# Altium schematic sheet 行天宮-流亡暗道.SchDoc
size A3
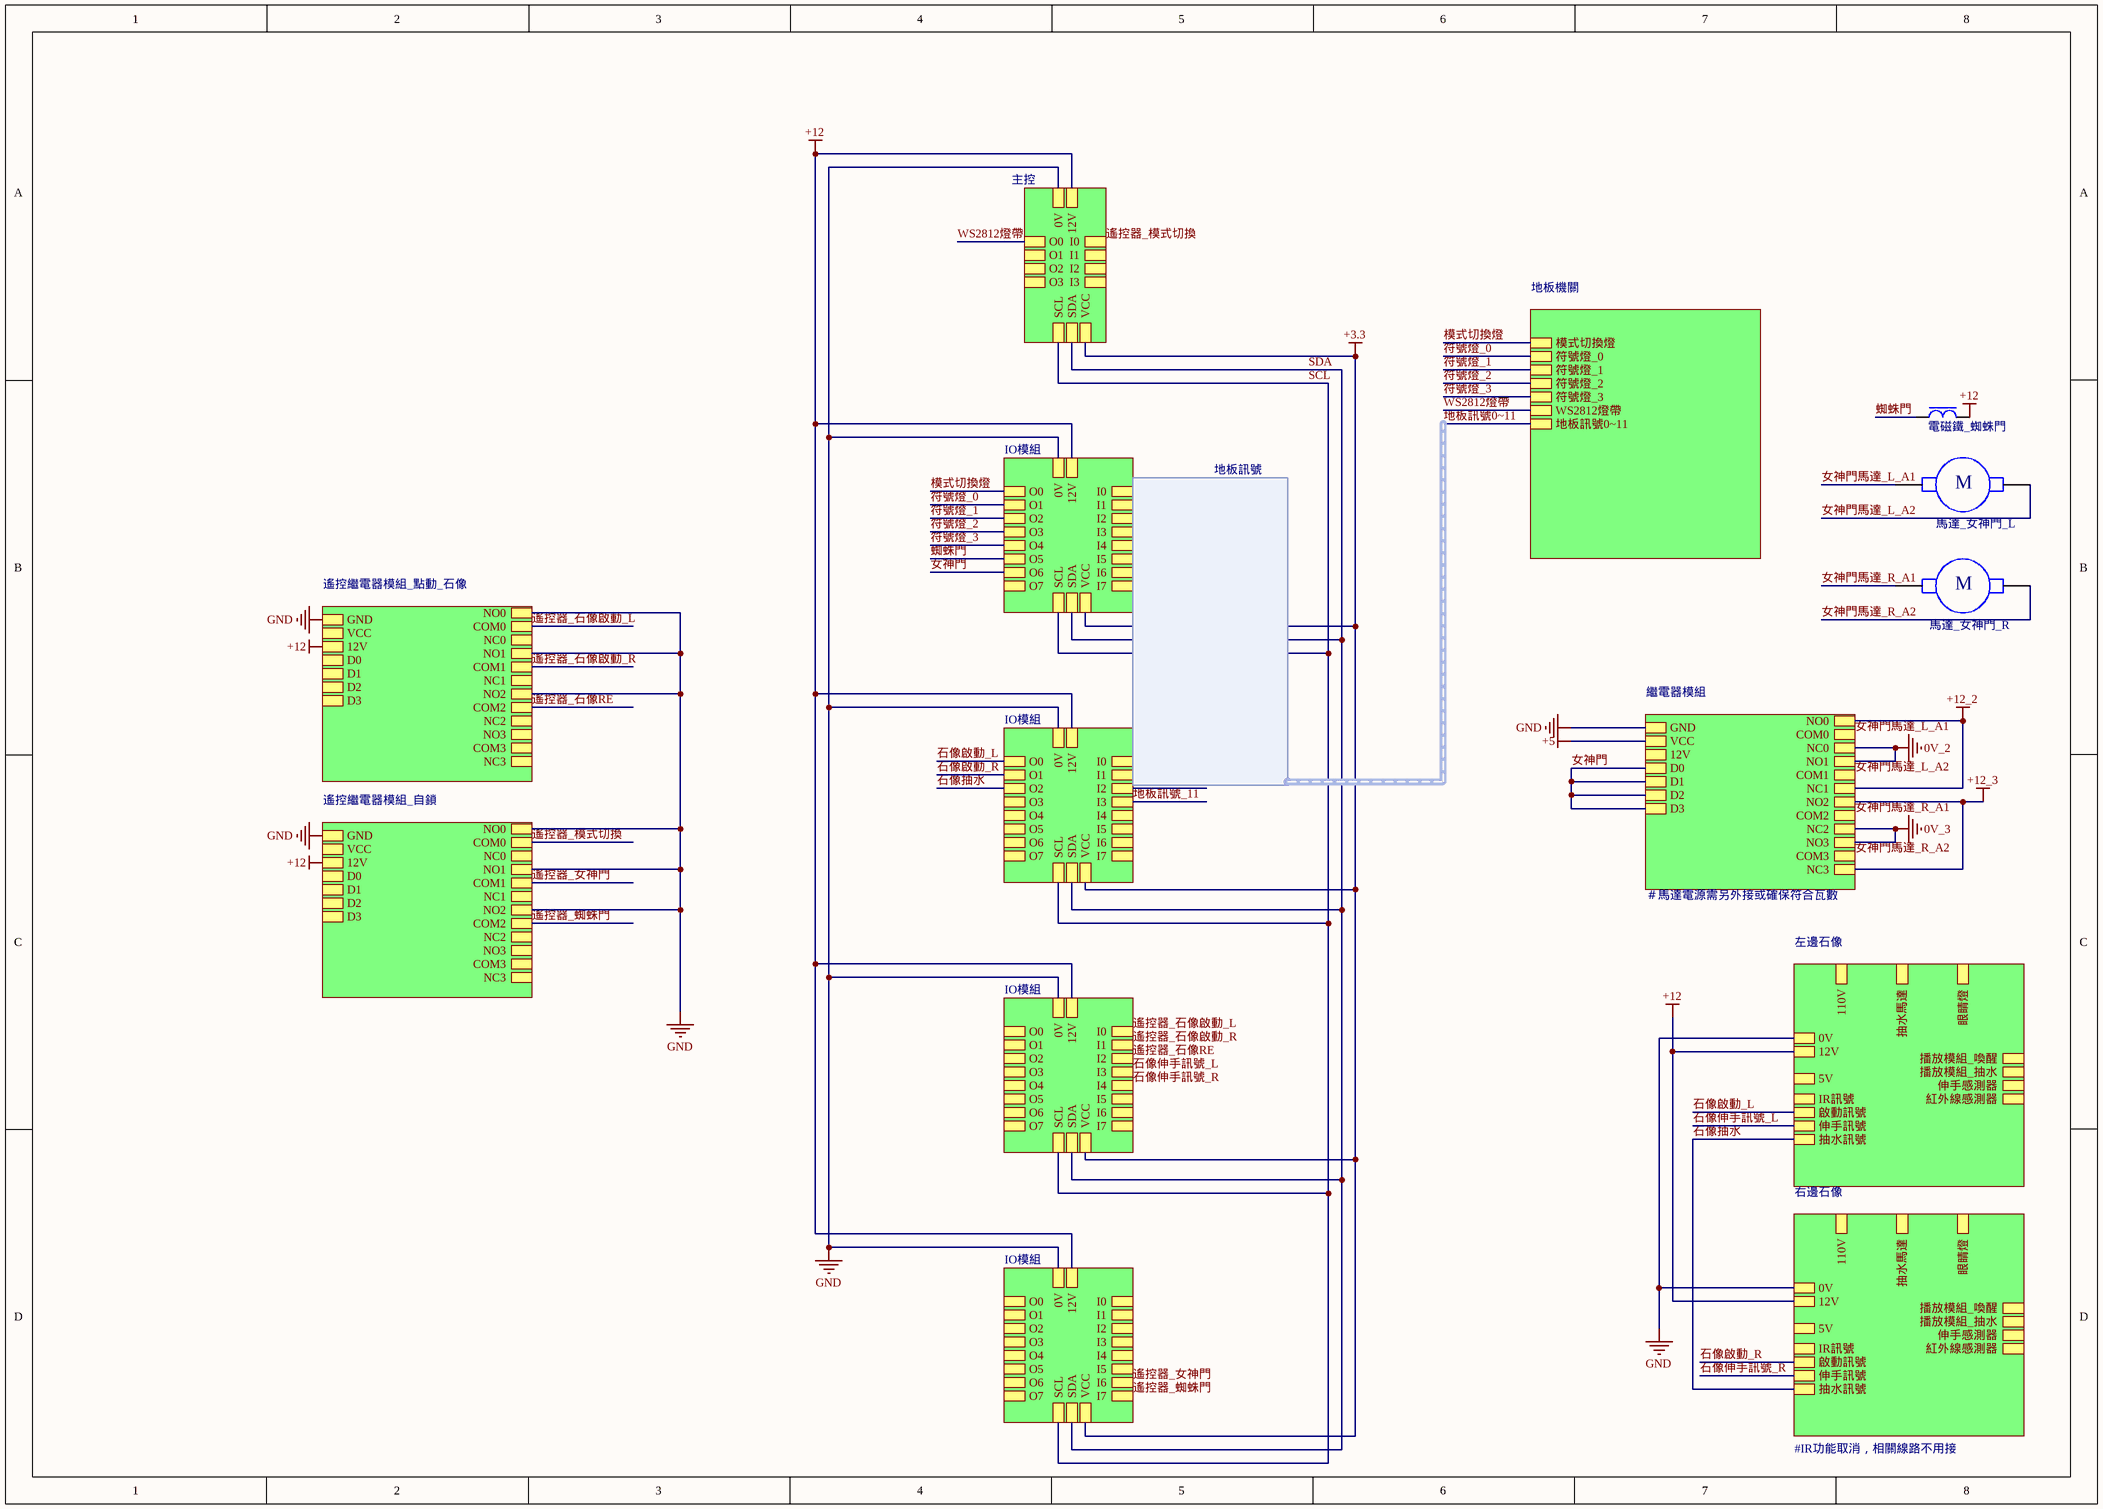
[diagram p0: 行天宮-流亡暗道.SchDoc]

## Parts
I7  電磁鐵_蜘蛛門  [Inductor-0420]
MD4  馬達_女神門_L
MD5  馬達_女神門_R

## Sub-sheets
IO模組 = IO模組_MCP23017_20240812.SchDoc: O5, O7, O3, I6, I7, O4, O1, I0, I1, I2, I3, I4, I5, O6, O2, O0, VCC, 12V, 0V, SCL, SDA
IO模組 = IO模組_MCP23017_20240812.SchDoc: O5, O7, O3, I6, I7, O4, O1, I0, I1, I2, I3, I4, I5, O6, O2, O0, VCC, 12V, 0V, SCL, SDA
IO模組 = IO模組_MCP23017_20240812.SchDoc: O5, O7, O3, I6, I7, O4, O1, I0, I1, I2, I3, I4, I5, O6, O2, O0, VCC, 12V, 0V, SCL, SDA
IO模組 = IO模組_MCP23017_20240812.SchDoc: O5, O7, O3, I6, I7, O4, O1, I0, I1, I2, I3, I4, I5, O6, O2, O0, VCC, 12V, 0V, SCL, SDA
主控 = ESP32主控_20240812.SchDoc: 12V, SDA, VCC, 0V, SCL, O3, O2, O1, O0, I3, I2, I1, I0
右邊石像 = 行天宮-流亡暗道-石像.SchDoc: 播放模組_抽水, 伸手訊號, 0V, 啟動訊號, 伸手感測器, 5V, 110V, 抽水訊號, 12V, 播放模組_喚醒, IR訊號, 眼睛燈, 紅外線感測器, 抽水馬達
地板機關 = File Name: 模式切換燈, 符號燈_0, 符號燈_1, 符號燈_3, 符號燈_2, 地板訊號0~11, WS2812燈帶
左邊石像 = 行天宮-流亡暗道-石像.SchDoc: 播放模組_抽水, 伸手訊號, 0V, 啟動訊號, 伸手感測器, 5V, 110V, 抽水訊號, 12V, 播放模組_喚醒, IR訊號, 眼睛燈, 紅外線感測器, 抽水馬達
繼電器模組 = 遙控繼電器.SchDoc: COM0, NO1, NO2, COM1, NC0, NO3, NO0, VCC, COM2, NC2, NC3, COM3, NC1, GND, 12V, D3, D2, D1, D0
遙控繼電器模組_自鎖 = 遙控繼電器.SchDoc: COM0, NO1, NO2, COM1, NC0, NO3, NO0, VCC, COM2, NC2, NC3, COM3, NC1, GND, 12V, D3, D2, D1, D0
遙控繼電器模組_點動_石像 = 遙控繼電器.SchDoc: COM0, NO1, NO2, COM1, NC0, NO3, NO0, VCC, COM2, NC2, NC3, COM3, NC1, GND, 12V, D3, D2, D1, D0

## Harnesses
地板訊號: 

## Nets
0V_2: sheet 繼電器模組/NO1, sheet 繼電器模組/NC0
0V_3: sheet 繼電器模組/NO3, sheet 繼電器模組/NC2
+3.3: sheet 主控/VCC, sheet IO模組/VCC, sheet IO模組/VCC, sheet IO模組/VCC, sheet IO模組/VCC
+5: sheet 繼電器模組/VCC
+12: I7.2 ; sheet 左邊石像/12V, sheet 主控/12V, sheet IO模組/12V, sheet IO模組/12V, sheet IO模組/12V, sheet IO模組/12V, sheet 右邊石像/12V, sheet 遙控繼電器模組_點動_石像/12V, sheet 遙控繼電器模組_自鎖/12V
+12_2: sheet 繼電器模組/NO0, sheet 繼電器模組/NC1
+12_3: sheet 繼電器模組/NO2, sheet 繼電器模組/NC3
GND: sheet 左邊石像/0V, sheet 主控/0V, sheet IO模組/0V, sheet IO模組/0V, sheet IO模組/0V, sheet IO模組/0V, sheet 右邊石像/0V, sheet 繼電器模組/GND, sheet 遙控繼電器模組_點動_石像/NO1, sheet 遙控繼電器模組_點動_石像/NO2, sheet 遙控繼電器模組_點動_石像/NO0, sheet 遙控繼電器模組_點動_石像/GND, sheet 遙控繼電器模組_自鎖/NO1, sheet 遙控繼電器模組_自鎖/NO2, sheet 遙控繼電器模組_自鎖/NO0, sheet 遙控繼電器模組_自鎖/GND
SCL: sheet 主控/SCL, sheet IO模組/SCL, sheet IO模組/SCL, sheet IO模組/SCL, sheet IO模組/SCL
SDA: sheet 主控/SDA, sheet IO模組/SDA, sheet IO模組/SDA, sheet IO模組/SDA, sheet IO模組/SDA
WS2812燈帶: sheet 主控/O0, sheet 地板機關/WS2812燈帶
地板訊號0~11: sheet 地板機關/地板訊號0~11
地板訊號_0: sheet IO模組/I0
地板訊號_1: sheet IO模組/I1
地板訊號_2: sheet IO模組/I2
地板訊號_3: sheet IO模組/I3
地板訊號_4: sheet IO模組/I4
地板訊號_5: sheet IO模組/I5
地板訊號_6: sheet IO模組/I6
地板訊號_7: sheet IO模組/I7
地板訊號_8: sheet IO模組/I0
地板訊號_9: sheet IO模組/I1
地板訊號_10: sheet IO模組/I2
地板訊號_11: sheet IO模組/I3
女神門: sheet IO模組/O6, sheet 繼電器模組/D3, sheet 繼電器模組/D2, sheet 繼電器模組/D1, sheet 繼電器模組/D0
女神門馬達_L_A1: MD4.4 ; sheet 繼電器模組/COM0
女神門馬達_L_A2: MD4.4 ; sheet 繼電器模組/COM1
女神門馬達_R_A1: MD5.4 ; sheet 繼電器模組/COM2
女神門馬達_R_A2: MD5.4 ; sheet 繼電器模組/COM3
模式切換燈: sheet IO模組/O0, sheet 地板機關/模式切換燈
石像伸手訊號_L: sheet 左邊石像/伸手訊號, sheet IO模組/I3
石像伸手訊號_R: sheet IO模組/I4, sheet 右邊石像/伸手訊號
石像啟動_L: sheet 左邊石像/啟動訊號, sheet IO模組/O0
石像啟動_R: sheet IO模組/O1, sheet 右邊石像/啟動訊號
石像抽水: sheet 左邊石像/抽水訊號, sheet IO模組/O2, sheet 右邊石像/抽水訊號
符號燈_0: sheet IO模組/O1, sheet 地板機關/符號燈_0
符號燈_1: sheet IO模組/O2, sheet 地板機關/符號燈_1
符號燈_2: sheet IO模組/O3, sheet 地板機關/符號燈_2
符號燈_3: sheet IO模組/O4, sheet 地板機關/符號燈_3
蜘蛛門: I7.1 ; sheet IO模組/O5
遙控器_女神門: sheet IO模組/I6, sheet 遙控繼電器模組_自鎖/COM1
遙控器_模式切換: sheet 主控/I0, sheet 遙控繼電器模組_自鎖/COM0
遙控器_石像RE: sheet IO模組/I2, sheet 遙控繼電器模組_點動_石像/COM2
遙控器_石像啟動_L: sheet IO模組/I0, sheet 遙控繼電器模組_點動_石像/COM0
遙控器_石像啟動_R: sheet IO模組/I1, sheet 遙控繼電器模組_點動_石像/COM1
遙控器_蜘蛛門: sheet IO模組/I7, sheet 遙控繼電器模組_自鎖/COM2

## Notes on the sheet
- ＃馬達電源需另外接或確保符合瓦數
- #IR功能取消，相關線路不用接
- (in symbol Motor_DC) M

## Library data of the parts
I7 = Inductor: 一體成型電感
MD4 MD5 = Motor_DC: 直流馬達